# Altium project PCB_Project.PrjPcb
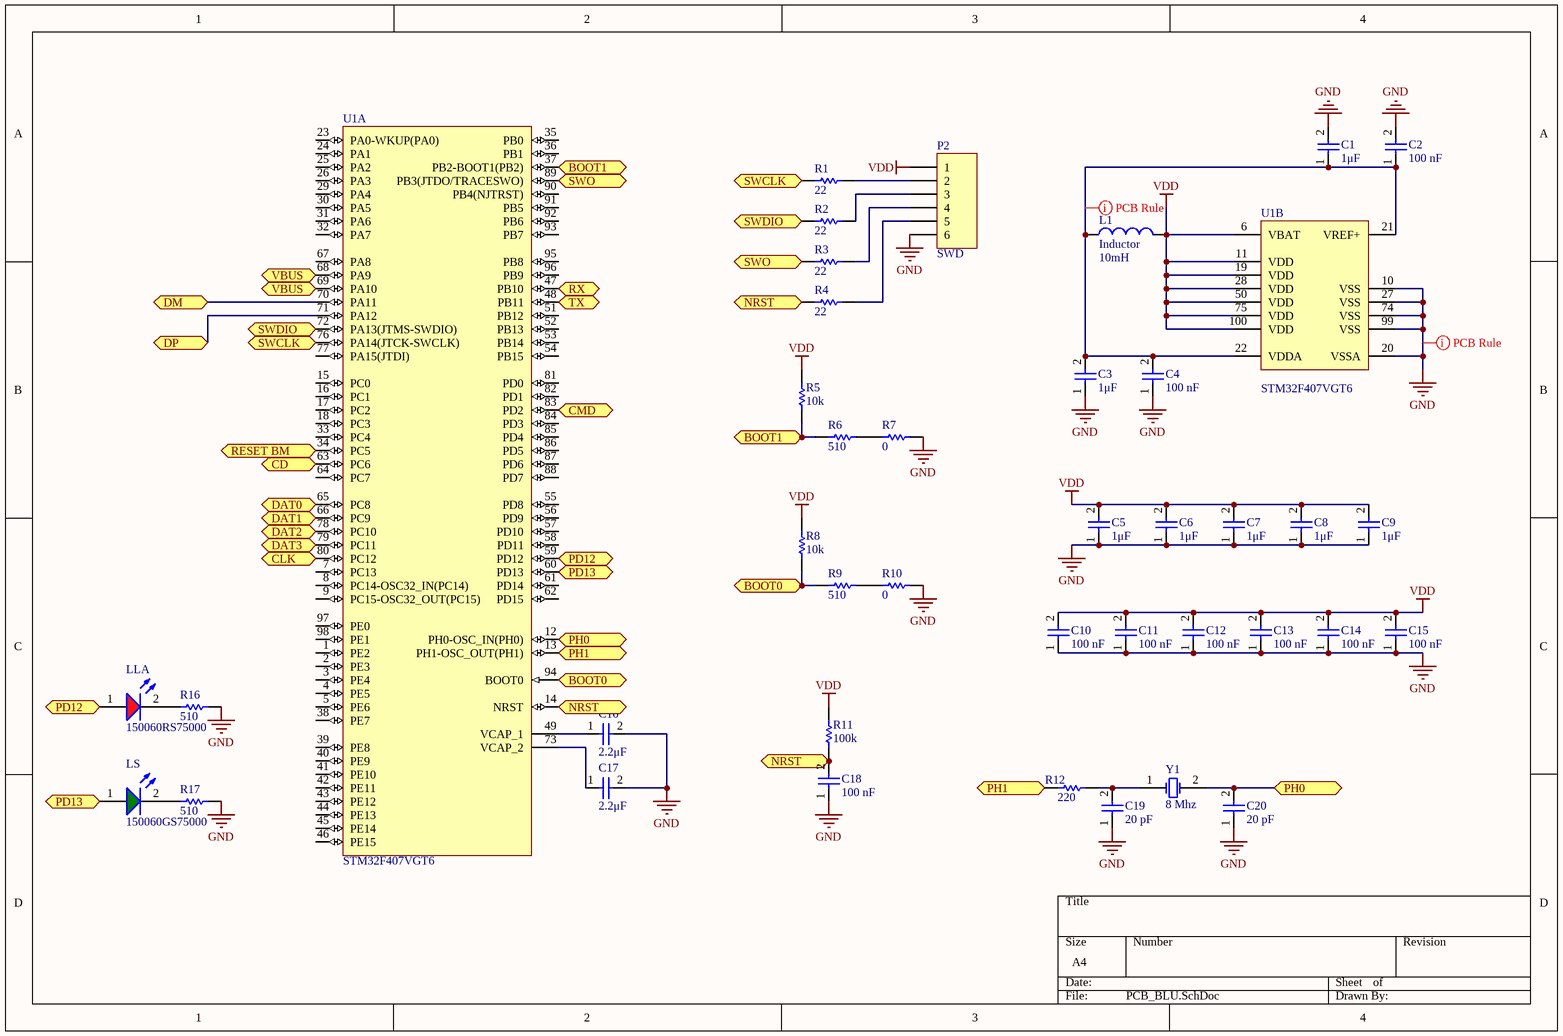
[diagram p0: PCB_BLU.SchDoc]
4 sheets, 74 parts. Net scope: flat (ports and power ports of the same name join across sheets).
Board file: PCB_BLU_2.PcbDoc
Sheets:
  PCB_BLU.SchDoc
  PCB_BLU1.SchDoc
  PCB_BLU2.SchDoc
  PCB_BLU3.SchDoc

## Sheet PCB_BLU.SchDoc
size A4

### Parts
C1  1μF  [WCAP-CSGP 1210, H=1.25mm]
C2  100 nF  [WCAP-CSGP 1206, H=0.8mm]
C3  1μF  [WCAP-CSGP 1210, H=1.25mm]
C4  100 nF  [WCAP-CSGP 1206, H=0.8mm]
C5  1μF  [WCAP-CSGP 1210, H=1.25mm]
C6  1μF  [WCAP-CSGP 1210, H=1.25mm]
C7  1μF  [WCAP-CSGP 1210, H=1.25mm]
C8  1μF  [WCAP-CSGP 1210, H=1.25mm]
C9  1μF  [WCAP-CSGP 1210, H=1.25mm]
C10  100 nF  [WCAP-CSGP 1206, H=0.8mm]
C11  100 nF  [WCAP-CSGP 1206, H=0.8mm]
C12  100 nF  [WCAP-CSGP 1206, H=0.8mm]
C13  100 nF  [WCAP-CSGP 1206, H=0.8mm]
C14  100 nF  [WCAP-CSGP 1206, H=0.8mm]
C15  100 nF  [WCAP-CSGP 1206, H=0.8mm]
C16  2.2μF  [WCAP-CSGP 0805, H=1.25mm]
C17  2.2μF  [WCAP-CSGP 0805, H=1.25mm]
C18  100 nF  [WCAP-CSGP 1206, H=0.8mm]
C19  20 pF  [WCAP-CSGP 0603, H=0.8mm]
C20  20 pF  [WCAP-CSGP 0603, H=0.8mm]
L1  Inductor  value 10mH  [0402-A]
LLA  150060RS75000  [LED_0603_Red]
LS  150060GS75000  [LED_0603_Green]
P2  SWD  [HDR1X6]
R1  22  [RES0402R]
R2  22  [RES0402R]
R3  22  [RES0402R]
R4  22  [RES0402R]
R5  10k  [RES0201R]
R6  510  [RES0201R]
R7  0  [RES0201R]
R8  10k  [RES0201R]
R9  510  [RES0201R]
R10  0  [RES0201R]
R11  100k  [RES0201R]
R12  220  [RES0402R]
R16  510  [RES0402R]
R17  510  [RES0402R]
U1  STM32F407VGT6  [STM-LQFP100_N]  (parts A,B of 2)
Y1  8 Mhz  [3SMXA]

### Ports
BOOT0 (bidir), BOOT1 (bidir), CD (bidir), CLK (bidir), CMD (bidir), DAT0 (bidir), DAT1 (bidir), DAT2 (bidir), DAT3 (bidir), DM (bidir), DP (bidir), NRST (bidir), PD12 (bidir), PD13 (bidir), PH0 (bidir), PH1 (bidir), RESET BM (bidir), RX (bidir), SWCLK (bidir), SWDIO (bidir), SWO (bidir), TX (in), VBUS (bidir)

### Nets
GND: C1.2 C2.2 C3.1 C4.1 C5.1 C6.1 C7.1 C8.1 C9.1 C10.1 C11.1 C12.1 C13.1 C14.1 C15.1 C16.2 C17.2 C18.1 C19.1 C20.1 P2.6 R7.1 R10.1 R16.1 R17.1 U1.10(VSS) U1.20(VSSA) U1.27(VSS) U1.74(VSS) U1.99(VSS)
VDD: C5.2 C6.2 C7.2 C8.2 C9.2 C10.2 C11.2 C12.2 C13.2 C14.2 C15.2 L1.2 P2.1 R5.2 R8.2 R11.1 U1.6(VBAT) U1.11(VDD) U1.19(VDD) U1.28(VDD) U1.50(VDD) U1.75(VDD) U1.100(VDD)
NetC1_1: C1.1 C2.1 C3.2 C4.2 L1.1 U1.21(VREF+) U1.22(VDDA)
NetC16_1: C16.1 U1.49(VCAP_1)
NetC17_1: C17.1 U1.73(VCAP_2)
NetC18_2: C18.2 R4.2 R11.2 U1.14(NRST) ; port NRST
NetC19_2: C19.2 R12.1 Y1.1(OSC1)
NetC20_2: C20.2 U1.12(PH0-OSC_IN(PH0)) Y1.2(OSC2) ; port PH0
NetD1_4: U1.71(PA12) ; port DP
NetD1_6: U1.70(PA11) ; port DM
NetJ1_1: U1.78(PC10) ; port DAT2
NetJ1_2: U1.79(PC11) ; port DAT3
NetJ1_3: U1.83(PD2) ; port CMD
NetJ1_5: U1.80(PC12) ; port CLK
NetJ1_7: U1.65(PC8) ; port DAT0
NetJ1_8: U1.66(PC9) ; port DAT1
NetJ1_10: U1.63(PC6) ; port CD
NetLLA_1: LLA.1(A) U1.59(PD12) ; port PD12
NetLLA_2: LLA.2(C) R16.2
NetLS_1: LS.1(A) U1.60(PD13) ; port PD13
NetLS_2: LS.2(C) R17.2
NetM1_5: U1.34(PC5) ; port RESET BM
NetP2_2: P2.2 R1.1
NetP2_3: P2.3 R2.1
NetP2_4: P2.4 R3.1
NetP2_5: P2.5 R4.1
NetR1_2: R1.2 U1.76(PA14(JTCK-SWCLK)) ; port SWCLK
NetR2_2: R2.2 U1.72(PA13(JTMS-SWDIO)) ; port SWDIO
NetR3_2: R3.2 U1.89(PB3(JTDO/TRACESWO)) ; port SWO
NetR5_1: R5.1 R6.2 U1.37(PB2-BOOT1(PB2)) ; port BOOT1
NetR6_1: R6.1 R7.2
NetR8_1: R8.1 R9.2 U1.94(BOOT0) ; port BOOT0
NetR9_1: R9.1 R10.2
NetR12_2: R12.2 U1.13(PH1-OSC_OUT(PH1)) ; port PH1
NetR34_1: U1.48(PB11) ; port TX
NetR35_1: U1.47(PB10) ; port RX
NetR37_2: U1.68(PA9) U1.69(PA10) ; port VBUS

Not connected (* = marked no-connect by the designer): U1 1(PE2) 2(PE3) 3(PE4) 4(PE5) 5(PE6) 7(PC13) 8(PC14-OSC32_IN(PC14)) 9(PC15-OSC32_OUT(PC15)) 15(PC0) 16(PC1) 17(PC2) 18(PC3) 23(PA0-WKUP(PA0)) 24(PA1) 25(PA2) 26(PA3) 29(PA4) 30(PA5) 31(PA6) 32(PA7) 33(PC4) 35(PB0) 36(PB1) 38(PE7) 39(PE8) 40(PE9) 41(PE10) 42(PE11) 43(PE12) 44(PE13) 45(PE14) 46(PE15) 51(PB12) 52(PB13) 53(PB14) 54(PB15) 55(PD8) 56(PD9) 57(PD10) 58(PD11) 61(PD14) 62(PD15) 64(PC7) 67(PA8) 77(PA15(JTDI)) 81(PD0) 82(PD1) 84(PD3) 85(PD4) 86(PD5) 87(PD6) 88(PD7) 90(PB4(NJTRST)) 91(PB5) 92(PB6) 93(PB7) 95(PB8) 96(PB9) 97(PE0) 98(PE1)

### Layout directives
rule Width Constraint [Pref Width = 0.3mil    Min Width = 0.2mil    Max Width = 0.3mil]: GND, NetC1_1

### Library data of the parts
C1 C3 C5-C9 = WCAP-CSGP 1210, 885012209011: WCAP-CSGP MLCC, X7R, 1210, 1μF pF,16Vdc; Manufacturer: Wurth Elektronik; E-mail: libraries@we-online.com; ComponentLink1Description: Manufacturer; ComponentLink1URL: http://www.we-online.com; ComponentLink2Description: Datasheet; ComponentLink2URL: http://katalog.we-online.de/pbs/datasheet/885012209011.pdf; Created by: Karrer Zheng; Created Date: 3/9/2015; Capacitance: 1μF; partNo: 885012209011
C2 C4 C10-C15 C18 = WCAP-CSGP 1206, 885012208009: WCAP-CSGP MLCC, X7R, 1206, 100000 pF,10Vdc; Manufacturer: Wurth Elektronik; E-mail: libraries@we-online.com; ComponentLink1Description: Manufacturer; ComponentLink1URL: http://www.we-online.com; ComponentLink2Description: Datasheet; ComponentLink2URL: http://katalog.we-online.de/pbs/datasheet/885012208009.pdf; Created by: Karrer Zheng; Created Date: 3/9/2015; Capacitance: 100 nF; partNo: 885012208009
C16 C17 = WCAP-CSGP 0805, 885012207024: WCAP-CSGP MLCC, X7R, 0805, 2.2μF ,10Vdc; Manufacturer: Wurth Elektronik; E-mail: libraries@we-online.com; ComponentLink1Description: Manufacturer; ComponentLink1URL: http://www.we-online.com; ComponentLink2Description: Datasheet; ComponentLink2URL: http://katalog.we-online.de/pbs/datasheet/885012207024.pdf; Created by: Karrer Zheng; Created Date: 3/9/2015; Capacitance: 2.2μF; partNo: 885012207024
C19 C20 = WCAP-CSGP 0603, 885012006004: WCAP-CSGP MLCC, NP0, 0603, 22 pF,10Vdc; Manufacturer: Wurth Elektronik; E-mail: libraries@we-online.com; ComponentLink1Description: Manufacturer; ComponentLink1URL: http://www.we-online.com; ComponentLink2Description: Datasheet; ComponentLink2URL: http://katalog.we-online.de/pbs/datasheet/885012006004.pdf; Created by: Karrer Zheng; Created Date: 3/9/2015; Capacitance: 20 pF; partNo: 885012006004
L1 = Inductor: Code_IEC: 1005; Published: 8-Jun-2000; LatestRevisionDate: 29-May-2009; LatestRevisionNote: IPC-7351 Footprint Added.; PackageReference: 0402-A; Publisher: Altium Limited; PackageDescription: Chip Inductor; Code_JEITA: 0402
LLA = WL-SMCW 0603  150060RS75000: SMD mono-color Chip LED, WL-SMCW, Red; Manufacturer: W黵th Elektronik eiSos GmbH; PartNo: 150060RS75000; ComponentLink1Description: Manufacturer; ComponentLink1URL: http://www.we-online.de; Created by: Christin Otto; Created Date: June 2013; ComponentLink2Description: Datasheet; ComponentLink2URL: http://katalog.we-online.com/led/datasheet/150060RS75000.pdf; Color: Red
LS = WL-SMCW 0603  150060GS75000: SMD mono-color Chip LED, WL-SMCW, Green; Manufacturer: W黵th Elektronik eiSos GmbH; PartNo: 150060GS75000; ComponentLink1Description: Manufacturer; ComponentLink1URL: http://www.we-online.de; Created by: Christin Otto; Created Date: June 2013; ComponentLink2Description: Datasheet; ComponentLink2URL: http://katalog.we-online.com/led/datasheet/150060GS75000.pdf; Color: Green
P2 = Header 6: Header, 6-Pin; LatestRevisionDate: 17-Jul-2002; LatestRevisionNote: Re-released for DXP Platform.; Publisher: Altium Limited
R1-R12 R16 R17 = Resistor1: Resistor; Value: =Value
U1 = STM32F407VGT6: ARM Cortex-M4 32-bit MCU+FPU, 210 DMIPS, 1024 kB Flash, 192 kB Internal RAM, 82 I/Os, 100-pin LQFP, -40 to 85 degC, Tray; Manufacturer: STMicroelectronics; D/A Converter: 2x12-bit; FLASH Size (Prog) (kB): 1024; I/Os (High Current): 82; Internal RAM Size (kB): 192; Operating Frequency(F) (Processor speed) (MHz): 168; Supply Voltage(Vcc) max (V): 3.6; Supply Voltage(Vcc) min (V): 1.8; DatasheetVersion: Rev. 4; PackageVersion: Rev. 1, 06/2013; PackageReference: LQFP100; PackageDescription: 100-Pin Low Profile Quad Flat Package, 14 x 14 mm Body, 0.5 mm Pitch; Supplier 1: Digi-Key; Supplier Part Number 1: 497-11605-ND; Supplier 2: Farnell; Supplier Part Number 2: 2064368; Supplier 3: Newark; Supplier Part Number 3: 73T2333; Supplier 4: Mouser; Supplier Part Number 4: 511-STM32F407VGT6; Core: ARM Cortex-M4; Packing: Tray; Mounting Technology: Surface Mount; PartNumber: STM32F407VGT6; ComponentLink1Description: Manufacturer URL; ComponentLink1URL: http://www.st.com/web/en/home.html; ComponentLink2Description: Datasheet; ComponentLink2URL: http://www.st.com/st-web-ui/static/active/en/resource/technical/document/datasheet/DM00037051.pdf; ComponentLink3Description: Package Specification; ComponentLink3URL: http://www.st.com/st-web-ui/static/active/en/resource/technical/document/data_brief/DM00071938.pdf
Y1 = XTAL: Crystal Oscillator; Published: 8-Jun-2000; LatestRevisionDate: 17-Jul-2002; LatestRevisionNote: Re-released for DXP Platform.; PackageReference: R38; Publisher: Altium Limited; PackageDescription: Crystal, Thru-Hole; 2 Leads; Body 3.1 x 8.2 mm (Dia.xH)

## Sheet PCB_BLU1.SchDoc
size A4
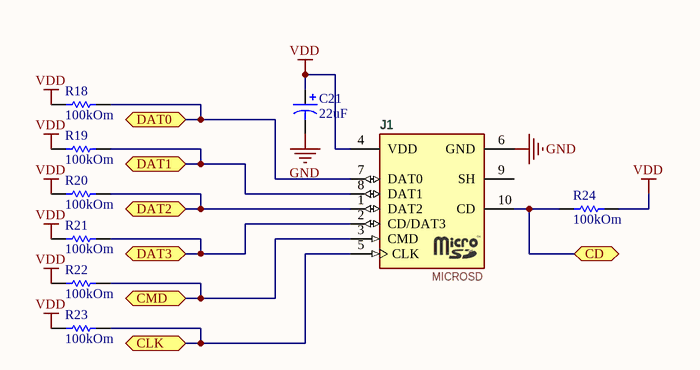
[diagram p1: PCB_BLU1.SchDoc]

### Parts
C21  22uF  [6032]
J1  MICROSD  [MICROSD]
R18  100kOm  [RES0201R]
R19  100kOm  [RES0201R]
R20  100kOm  [RES0201R]
R21  100kOm  [RES0201R]
R22  100kOm  [RES0201R]
R23  100kOm  [RES0201R]
R24  100kOm  [RES0201R]

### Ports
CD (bidir), CLK (bidir), CMD (bidir), DAT0 (bidir), DAT1 (bidir), DAT2 (bidir), DAT3 (bidir)

### Nets
GND: C21.2 J1.6(GND)
VDD: C21.1 J1.4(VDD) R18.2 R19.2 R20.2 R21.2 R22.2 R23.2 R24.1
NetJ1_1: J1.1(DAT2) R20.1 ; port DAT2
NetJ1_2: J1.2(CD/DAT3) R21.1 ; port DAT3
NetJ1_3: J1.3(CMD) R22.1 ; port CMD
NetJ1_5: J1.5(CLK) R23.1 ; port CLK
NetJ1_7: J1.7(DAT0) R18.1 ; port DAT0
NetJ1_8: J1.8(DAT1) R19.1 ; port DAT1
NetJ1_10: J1.10(CD) R24.2 ; port CD

Not connected (* = marked no-connect by the designer): J1 9(SH)

### Library data of the parts
C21 = CWR11DH226M: Tantamount Military, Surface Mount MIL-PRF-55365/8 Qualified Solid Tantalum Chip Capacitor: 22uF, 20% Tolerance, 6 WVDC @ +85°C, Surge = 8V; Note: See Data Sheet for full range of components; Published: 19-Mar-2004; DatasheetDocument: 20-Mar-2003; PackageReference: 6032; Publisher: Altium Limited; Code_JEITA: 6032; ComponentLink1Description: Manufacturer Link; ComponentLink1URL: http://www.vishay.com/; ComponentLink2Description: Datasheet; ComponentLink2URL: http://www.vishay.com/docs/40011/cwr11.pdf; Value: 22uF
J1 = MICROSD: Memory Card Connectors Molex 504528-0892
R18-R24 = Resistor1: Resistor; Value: =Value

## Sheet PCB_BLU2.SchDoc
size A4
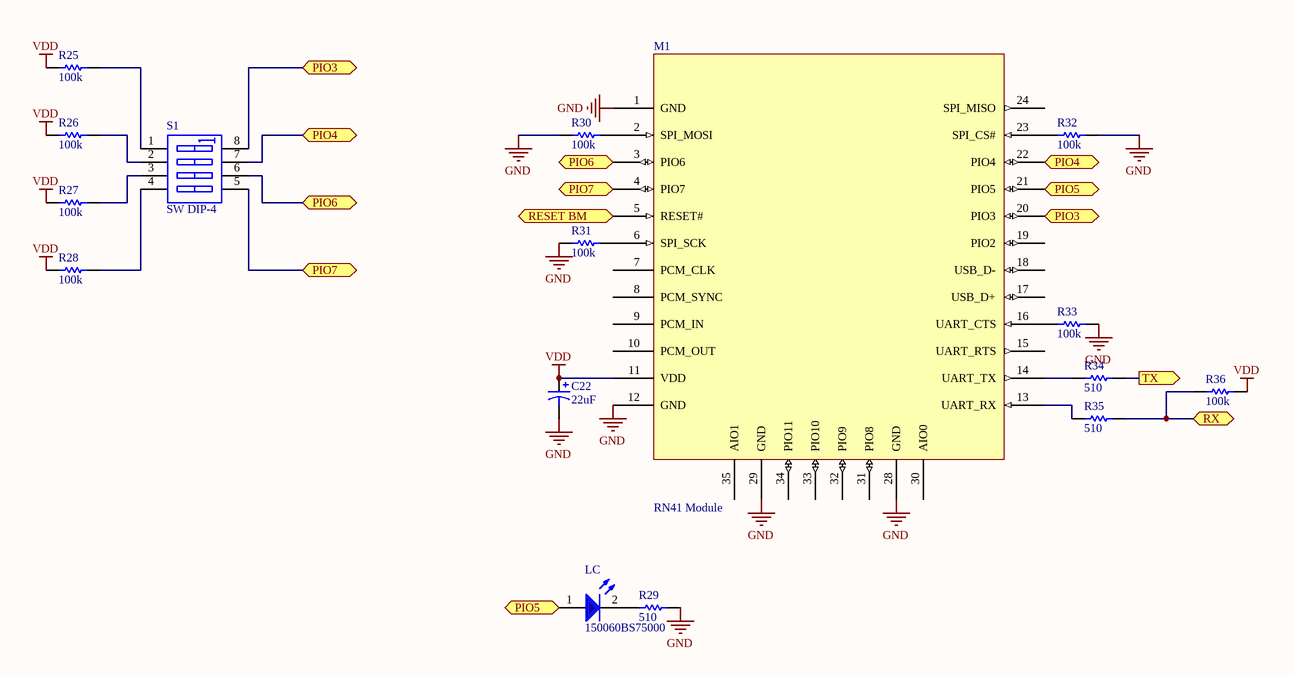
[diagram p2: PCB_BLU2.SchDoc]

### Parts
C22  22uF  [6032]
LC  150060BS75000  [LED_0603_Blue]
M1  RN41 Module  [RN42-LAND]
R25  100k  [RES0402R]
R26  100k  [RES0402R]
R27  100k  [RES0402R]
R28  100k  [RES0402R]
R29  510  [RES0402R]
R30  100k  [RES0201R]
R31  100k  [RES0201R]
R32  100k  [RES0201R]
R33  100k  [RES0201R]
R34  510  [RES0201R]
R35  510  [RES0201R]
R36  100k  [RES0201R]
S1  SW DIP-4  [SO8_N]

### Ports
PIO3 (bidir), PIO4 (bidir), PIO5 (bidir), PIO6 (bidir), PIO7 (bidir), RESET BM (bidir), RX (bidir), TX (out)

### Nets
GND: C22.2 M1.1(GND) M1.12(GND) M1.28(GND) M1.29(GND) R29.2 R30.2 R31.2 R32.1 R33.1
VDD: C22.1 M1.11(VDD) R25.2 R26.2 R27.2 R28.2 R36.1
NetLC_1: LC.1(A) M1.21(PIO5) ; port PIO5
NetLC_2: LC.2(C) R29.1
NetM1_2: M1.2(SPI_MOSI) R30.1
NetM1_3: M1.3(PIO6) S1.6(B3) ; port PIO6
NetM1_4: M1.4(PIO7) S1.5(B4) ; port PIO7
NetM1_5: M1.5(RESET#) ; port RESET BM
NetM1_6: M1.6(SPI_SCK) R31.1
NetM1_13: M1.13(UART_RX) R35.2
NetM1_14: M1.14(UART_TX) R34.2
NetM1_16: M1.16(UART_CTS) R33.2
NetM1_20: M1.20(PIO3) S1.8(B1) ; port PIO3
NetM1_22: M1.22(PIO4) S1.7(B2) ; port PIO4
NetM1_23: M1.23(SPI_CS#) R32.2
NetR25_1: R25.1 S1.1(A1)
NetR26_1: R26.1 S1.2(A2)
NetR27_1: R27.1 S1.3(A3)
NetR28_1: R28.1 S1.4(A4)
NetR34_1: R34.1 ; port TX
NetR35_1: R35.1 R36.2 ; port RX

Not connected (* = marked no-connect by the designer): M1 7(PCM_CLK) 8(PCM_SYNC) 9(PCM_IN) 10(PCM_OUT) 15(UART_RTS) 17(USB_D+) 18(USB_D-) 19(PIO2) 24(SPI_MISO) 30(AIO0) 31(PIO8) 32(PIO9) 33(PIO10) 34(PIO11) 35(AIO1)

### Library data of the parts
C22 = CWR11DH226M: as C21 on sheet PCB_BLU1; Published: 19-Mar-2004; DatasheetDocument: 20-Mar-2003; PackageReference: 6032; Publisher: Altium Limited; Code_JEITA: 6032; ComponentLink1Description: Manufacturer Link; ComponentLink1URL: http://www.vishay.com/; ComponentLink2Description: Datasheet; ComponentLink2URL: http://www.vishay.com/docs/40011/cwr11.pdf; Value: 22uF
LC = WL-SMCW 0603  150060BS75000: SMD mono-color Chip LED, WL-SMCW, Blue; Manufacturer: W黵th Elektronik eiSos GmbH; PartNo: 150060BS75000; ComponentLink1Description: Manufacturer; ComponentLink1URL: http://www.we-online.de; Created by: Christin Otto; Created Date: June 2013; ComponentLink2Description: Datasheet; ComponentLink2URL: http://katalog.we-online.com/led/datasheet/150060BS75000.pdf; Color: Blue
M1 = RN42MOD: RN41-I/RM; Value: RN42
R25-R36 = Resistor1: Resistor; Value: =Value
S1 = SW DIP-4: DIP Switch, 4 Position, SPST; Published: 24-Mar-1999; LatestRevisionDate: 29-May-2009; LatestRevisionNote: IPC-7351 Footprint Added.; PackageVersion: Dec-2002; PackageReference: SO8; Publisher: Altium Limited; PackageDescription: 8-Pin Small Outline Integrated Circuit 1.27 mm Pitch; Code_JEDEC: MS-012-AA; Code_IPC: SOIC127P600-8

## Sheet PCB_BLU3.SchDoc
size A4
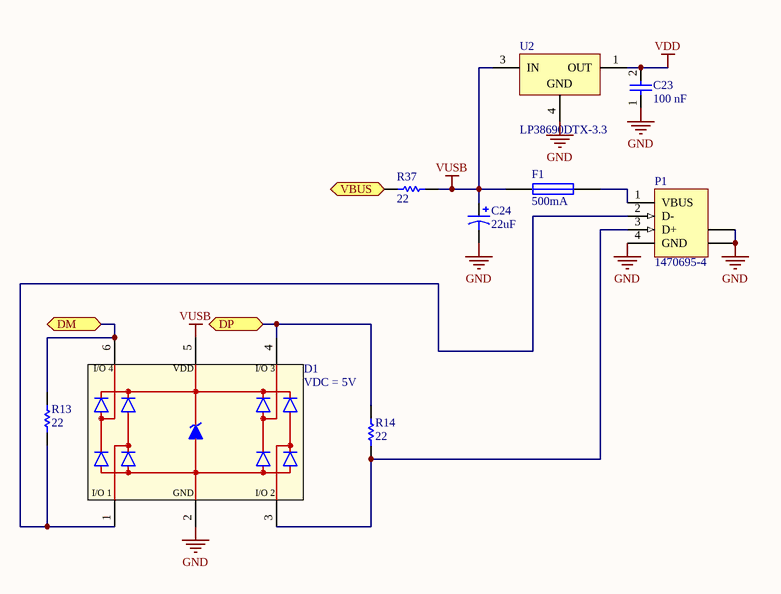
[diagram p3: PCB_BLU3.SchDoc]

### Parts
C23  100 nF  [WCAP-CSGP 1206, H=0.8mm]
C24  22uF  [6032]
D1  VDC = 5V  [SOT23-6L]
F1  500mA  [RES2512R]
P1  1470695-4  [1470695A]
R13  22  [RES0402R]
R14  22  [RES0402R]
R37  22  [RES0402R]
U2  LP38690DTX-3.3  [TD03B_N]

### Ports
DM (bidir), DP (bidir), VBUS (bidir)

### Nets
GND: C23.1 C24.2 D1.2(GND) P1.4(GND) P1.5(SHLD) P1.6(SHLD) U2.4(GND)
VDD: C23.2 U2.1(OUT)
VUSB: C24.1 D1.5(VDD) F1.1 R37.1 U2.3(IN)
NetD1_1: D1.1(I/O_1) P1.2(D-) R13.1
NetD1_3: D1.3(I/O_2) P1.3(D+) R14.1
NetD1_4: D1.4(I/O_3) R14.2 ; port DP
NetD1_6: D1.6(I/O_4) R13.2 ; port DM
NetF1_2: F1.2 P1.1(VBUS)
NetR37_2: R37.2 ; port VBUS

### Library data of the parts
C23 = WCAP-CSGP 1206, 885012208009: as C2 on sheet PCB_BLU; ComponentLink1Description: Manufacturer; ComponentLink1URL: http://www.we-online.com; ComponentLink2Description: Datasheet; ComponentLink2URL: http://katalog.we-online.de/pbs/datasheet/885012208009.pdf; Created by: Karrer Zheng; Created Date: 3/9/2015; Capacitance: 100 nF; partNo: 885012208009
C24 = CWR11DH226M: as C21 on sheet PCB_BLU1; Published: 19-Mar-2004; DatasheetDocument: 20-Mar-2003; PackageReference: 6032; Publisher: Altium Limited; Code_JEITA: 6032; ComponentLink1Description: Manufacturer Link; ComponentLink1URL: http://www.vishay.com/; ComponentLink2Description: Datasheet; ComponentLink2URL: http://www.vishay.com/docs/40011/cwr11.pdf; Value: 22uF
D1 = WE-TVS, SOT23-6L, 824015: WE-TVS TVS Diode, High Speed Series, SOT23-6L, VDC = 5V; PartNo: 824015; Manufacturer: Wurth Elektronik; VDC: 5V; ComponentLink1Description: Manufacturer; ComponentLink1URL: http://www.we-online.de; Created by: BJ.Chen; Created Date: Jan 2016; ComponentLink2Description: Datasheet; ComponentLink2URL: http://katalog.we-online.de/pbs/datasheet/824015.pdf
F1 = Fuse 1: Fuse; Published: 8-Jun-2000; LatestRevisionDate: 17-Jul-2002; LatestRevisionNote: Re-released for DXP Platform.; PackageReference: PIN-W2/E2.8; Publisher: Altium Limited; PackageDescription: Thru-Hole; 2 Leads
P1 = 1470695-4: USB 1.1, Right Angle, SMT, A Type, Plug, 4 Position, Black; ContactMaterial: Brass; ContactPlating: Gold (30) over Nickel (50); PCB_Layout: Complies with manufacturer's recommendation.; DrillSize: Corresponds to nominal value.; PanelGround: Without; Published: 15-Jul-2004; DatasheetDocument: 21-Jan-2003; PackageDocument: 21-Jan-2003; PackageReference: 1470695A; Publisher: Altium Limited; HousingMaterial: Thermoplastic; ComponentLink1Description: Manufacturer Link; ComponentLink1URL: http://www.tycoelectronics.com/; ComponentLink2Description: Packaging Specification; ComponentLink2URL: http://ecommas.tycoelectronics.com/commerce/DocumentDelivery/DDEController?Action=showdoc&DocId=Customer+Drawing%7F1470695%7FO%7Fpdf%7FEnglish%7FC_1470695_O.pdf
R13 R14 R37 = Resistor1: Resistor; Value: =Value
U2 = LP38690DTX-3.3: 1A Low Dropout CMOS Linear Regulators Stable with Ceramic Output Capacitors, 3-pin TO-252; Manufacturer: National Semiconductor; PackageTopMarking: NSUZXYTT*LP38690*DT-3.3; PowerWise: Y; CompType: LDO IC; DatasheetVersion: May-2005; PackageVersion: revD, Feb-2009; PackageReference: TD03B; PackageDescription: TO252, Molded, Jedec, 6.8 x 6.10 x 2.30mm Body, 3 Lead, 2.28mm Pitch, Surface Mount; PartNumber: LP38690DTX-3.3; RoHS: N; PinCount: 3; High-Reliability: Y; Code_JEDEC: TO-252-AA; ComponentLink1Description: Manufacturer URL; ComponentLink1URL: http://www.national.com/; ComponentLink2Description: LP38690 Datasheet; ComponentLink2URL: http://www.national.com/ds/LP/LP38690.pdf; ComponentLink3Description: LP38690 Web Page; ComponentLink3URL: http://www.national.com/pf/LP/LP38690.html; ComponentLink4Description: TD03B Package Page; ComponentLink4URL: http://www.national.com/packaging/folders/td03b.html

## Nets that join several sheets
GND: PCB_BLU (30 pins), PCB_BLU1 (C21.2 J1.6), PCB_BLU2 (10 pins), PCB_BLU3 (7 pins)
VDD: PCB_BLU (23 pins), PCB_BLU1 (9 pins), PCB_BLU2 (7 pins), PCB_BLU3 (C23.2 U2.1)
NetD1_4: PCB_BLU (U1.71), PCB_BLU3 (D1.4 R14.2)
NetD1_6: PCB_BLU (U1.70), PCB_BLU3 (D1.6 R13.2)
NetJ1_1: PCB_BLU (U1.78), PCB_BLU1 (J1.1 R20.1)
NetJ1_2: PCB_BLU (U1.79), PCB_BLU1 (J1.2 R21.1)
NetJ1_3: PCB_BLU (U1.83), PCB_BLU1 (J1.3 R22.1)
NetJ1_5: PCB_BLU (U1.80), PCB_BLU1 (J1.5 R23.1)
NetJ1_7: PCB_BLU (U1.65), PCB_BLU1 (J1.7 R18.1)
NetJ1_8: PCB_BLU (U1.66), PCB_BLU1 (J1.8 R19.1)
NetJ1_10: PCB_BLU (U1.63), PCB_BLU1 (J1.10 R24.2)
NetM1_5: PCB_BLU (U1.34), PCB_BLU2 (M1.5)
NetR34_1: PCB_BLU (U1.48), PCB_BLU2 (R34.1)
NetR35_1: PCB_BLU (U1.47), PCB_BLU2 (R35.1 R36.2)
NetR37_2: PCB_BLU (U1.68 U1.69), PCB_BLU3 (R37.2)